# Altium project usbcharger.PrjPCB
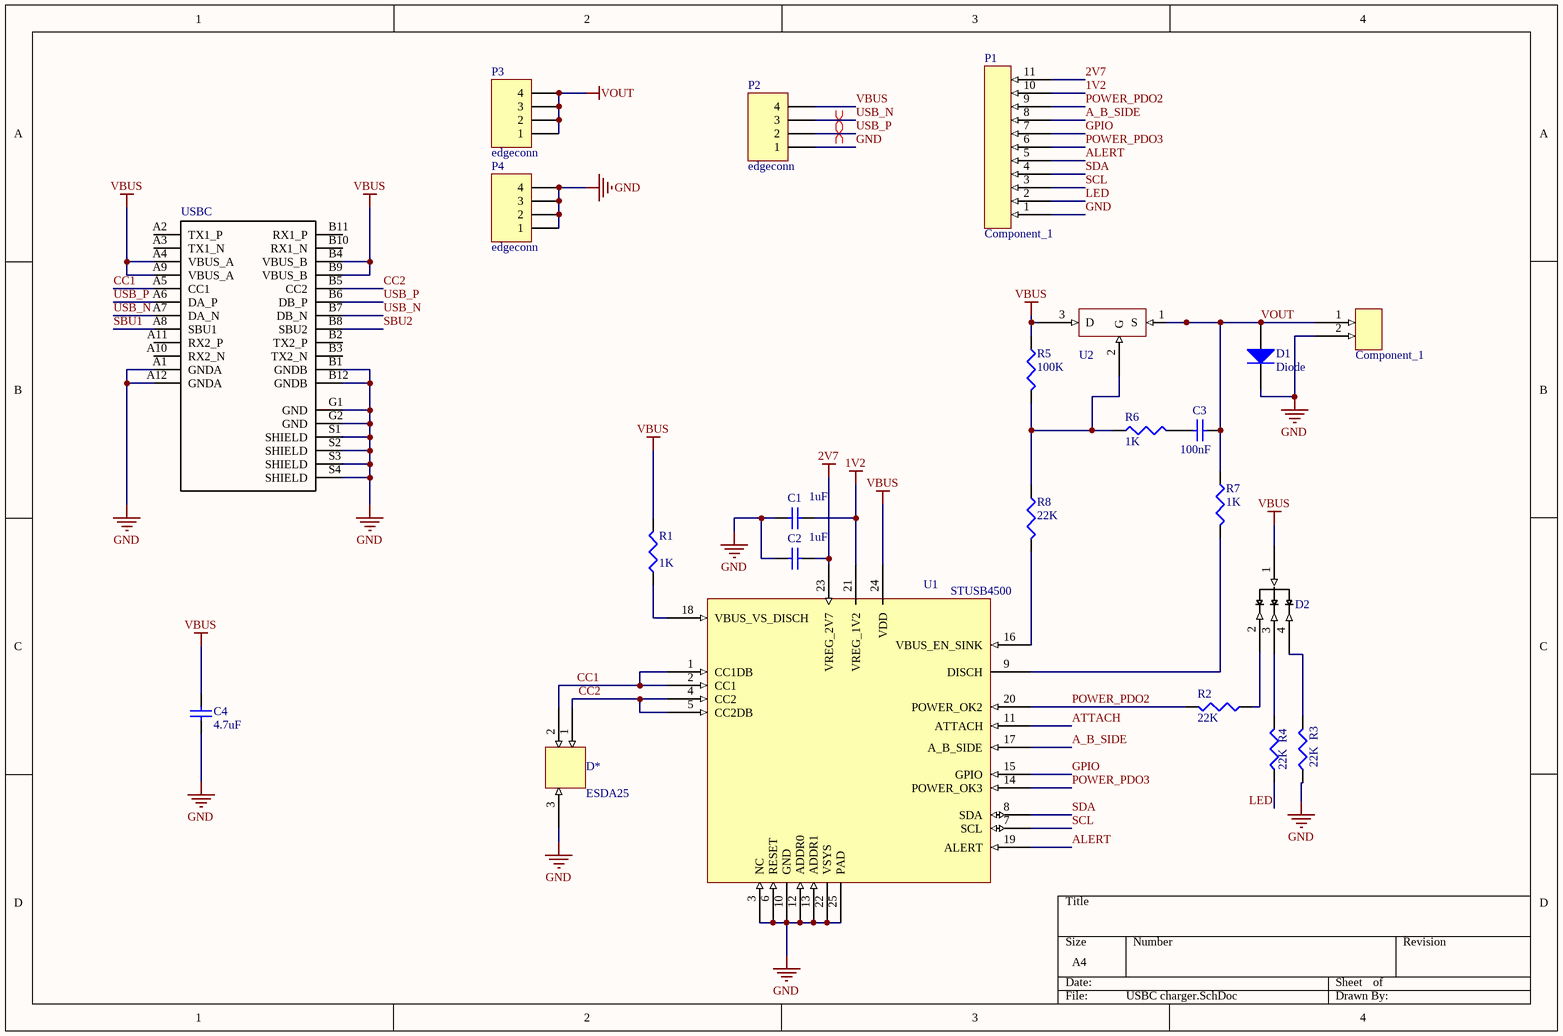
[diagram p0: USBC charger.SchDoc]
1 sheet, 23 parts. Net scope: global (net labels, ports and power ports of the same name join across sheets).
Board file: USBC charger.PcbDoc

## Sheet USBC charger.SchDoc
size A4

### Parts
*  Component_1  [2pinSrewconnectyor]
C1  value 1uF  [1608[0603]]  (hidden comment: Cap Semi)
C2  value 1uF  [1608[0603]]  (hidden comment: Cap Semi)
C3  value 100nF  [1608[0603]]  (hidden comment: Cap Semi)
C4  value 4.7uF  [C2512]  (hidden comment: Cap Semi)
D1  Diode  [3.2X1.6X1.1]
D2  SmollCree  [SmollLedCree]  (value not drawn)
D*  ESDA25  [SOT95P245X110-3N]
P1  Component_1  [edgecon - large]
P2  edgeconn  [edgecon]
P3  edgeconn  [edgecon - power]
P4  edgeconn  [edgecon - power]
R1  value 1K  [J1-0603]  (hidden comment: Res3)
R2  value 22K  [J1-0603]  (hidden comment: Res3)
R3  value 22K  [J1-0603]  (hidden comment: Res3)
R4  value 22K  [J1-0603]  (hidden comment: Res3)
R5  value 100K  [J1-0603]  (hidden comment: Res3)
R6  value 1K  [J1-0603]  (hidden comment: Res3)
R7  value 1K  [J1-0603]  (hidden comment: Res3)
R8  value 22K  [J1-0603]  (hidden comment: Res3)
U1  STUSB4500  [QFN50P400X400X80_HS-25N]
U2  STL6P3LLH6  [powerflat]  (value not drawn)
USBC  2305018-2  [*TE_2305018-2_2305018-2(Primary)]  (value not drawn)

### Nets
1V2: C1.2 P1.10 U1.21(VREG_1V2)
2V7: C2.2 P1.11 U1.23(VREG_2V7)
GND: *.2 C1.1 C2.1 C4.1 D1.2(K) D*.3 P1.1 P2.1 P4.1 P4.2 P4.3 P4.4 R3.1 U1.3(NC) U1.6(RESET) U1.10(GND) U1.12(ADDR0) U1.13(ADDR1) U1.22(VSYS) U1.25(PAD) USBC.A1(GNDA) USBC.A12(GNDA) USBC.B1(GNDB) USBC.B12(GNDB) USBC.G1(GND) USBC.G2(GND) USBC.S1(SHIELD) USBC.S2(SHIELD) USBC.S3(SHIELD) USBC.S4(SHIELD)
VBUS: C4.2 D2.1 P2.4 R1.2 R5.1 U1.24(VDD) U2.3(D) USBC.A4(VBUS_A) USBC.A9(VBUS_A) USBC.B4(VBUS_B) USBC.B9(VBUS_B)
VOUT: *.1 C3.2 D1.1(A) P3.1 P3.2 P3.3 P3.4 R7.1 U2.1(S)
A_B_SIDE: P1.8 U1.17(A_B_SIDE)
ALERT: P1.5 U1.19(ALERT)
ATTACH: U1.11(ATTACH)
CC1: D*.2 U1.1(CC1DB) U1.2(CC1) USBC.A5(CC1)
CC2: D*.1 U1.4(CC2) U1.5(CC2DB) USBC.B5(CC2)
GPIO: P1.7 U1.15(GPIO)
LED: P1.2 R4.1
POWER_PDO2: P1.9 R2.2 U1.20(POWER_OK2)
POWER_PDO3: P1.6 U1.14(POWER_OK3)
SBU1: USBC.A8(SBU1)
SBU2: USBC.B8(SBU2)
SCL: P1.3 U1.7(SCL)
SDA: P1.4 U1.8(SDA)
USB_N: P2.3 USBC.A7(DA_N) USBC.B7(DB_N)
USB_P: P2.2 USBC.A6(DA_P) USBC.B6(DB_P)
NetC3_1: C3.1 R6.2
NetD2_2: D2.2(Blue) R2.1
NetD2_3: D2.3 R4.2
NetD2_4: D2.4 R3.2
NetR1_1: R1.1 U1.18(VBUS_VS_DISCH)
NetR5_2: R5.2 R6.1 R8.1 U2.2(G)
NetR7_2: R7.2 U1.9(DISCH)
NetR8_2: R8.2 U1.16(VBUS_EN_SINK)

Not connected (* = marked no-connect by the designer): USBC A2(TX1_P) A3(TX1_N) A10(RX2_N) A11(RX2_P) B2(TX2_P) B3(TX2_N) B10(RX1_N) B11(RX1_P)

### Layout directives
differential pair: USB_N, USB_P

### Library data of the parts
C1-C4 = Cap Semi: Capacitor (Semiconductor SIM Model); Published: 8-Jun-2000; LatestRevisionDate: 29-May-2009; LatestRevisionNote: IPC-7351 Footprint Added.; PackageReference: C1206; Publisher: Altium Limited; PackageDescription: Chip Capacitor
D1 = Diode: Default Diode; Published: 8-Jun-2000; LatestRevisionDate: 17-Jul-2002; LatestRevisionNote: Re-released for DXP Platform.; PackageVersion: Sep-1996; PackageReference: SMC; Publisher: Altium Limited; PackageDescription: DO-214-AB/SMC; 2 C-Bend Leads; Body 7.9 x 5.9 mm, inc. leads (LxW); Code_JEDEC: DO-214-AB
D* = Component_1: Generic Sot23 package
P2-P4 = edgeconn: Header, 4-Pin; LatestRevisionDate: 17-Jul-2002; LatestRevisionNote: Re-released for DXP Platform.; Publisher: Altium Limited
R1-R8 = Res3: Resistor; Published: 8-Jun-2000; LatestRevisionDate: 29-May-2009; LatestRevisionNote: IPC-7351 Footprint Added.; PackageReference: J1-0603; Publisher: Altium Limited; PackageDescription: Chip Resistor
U1 = STUSB4500: stusb4500 PD ic
USBC = 2305018-2: TYPE C Right Angle Sealable SMT IPX8 3.1 GEN 2 Wire to Board USB; MF: TE Connectivity; TE_purchase_URL: https://www.te.com/usa-en/product-2305018-2.html?te_bu=Cor&te_type=disp&te_campaign=seda_glo_cor-seda-global-disp-prtnr-fy19-seda-model-bom-cta_sma-317_1&elqCampaignId=32493; SnapEDA_Link: https://www.snapeda.com/parts/2305018-2/TE%20Connectivity%20AMP%20Connectors/view-part/?ref=snap; Availability: Unavailable; Package: None; Price: None; MP: 2305018-2; Value: *